# EAGLE schematic Relaya_original (EAGLE 9.1.2)
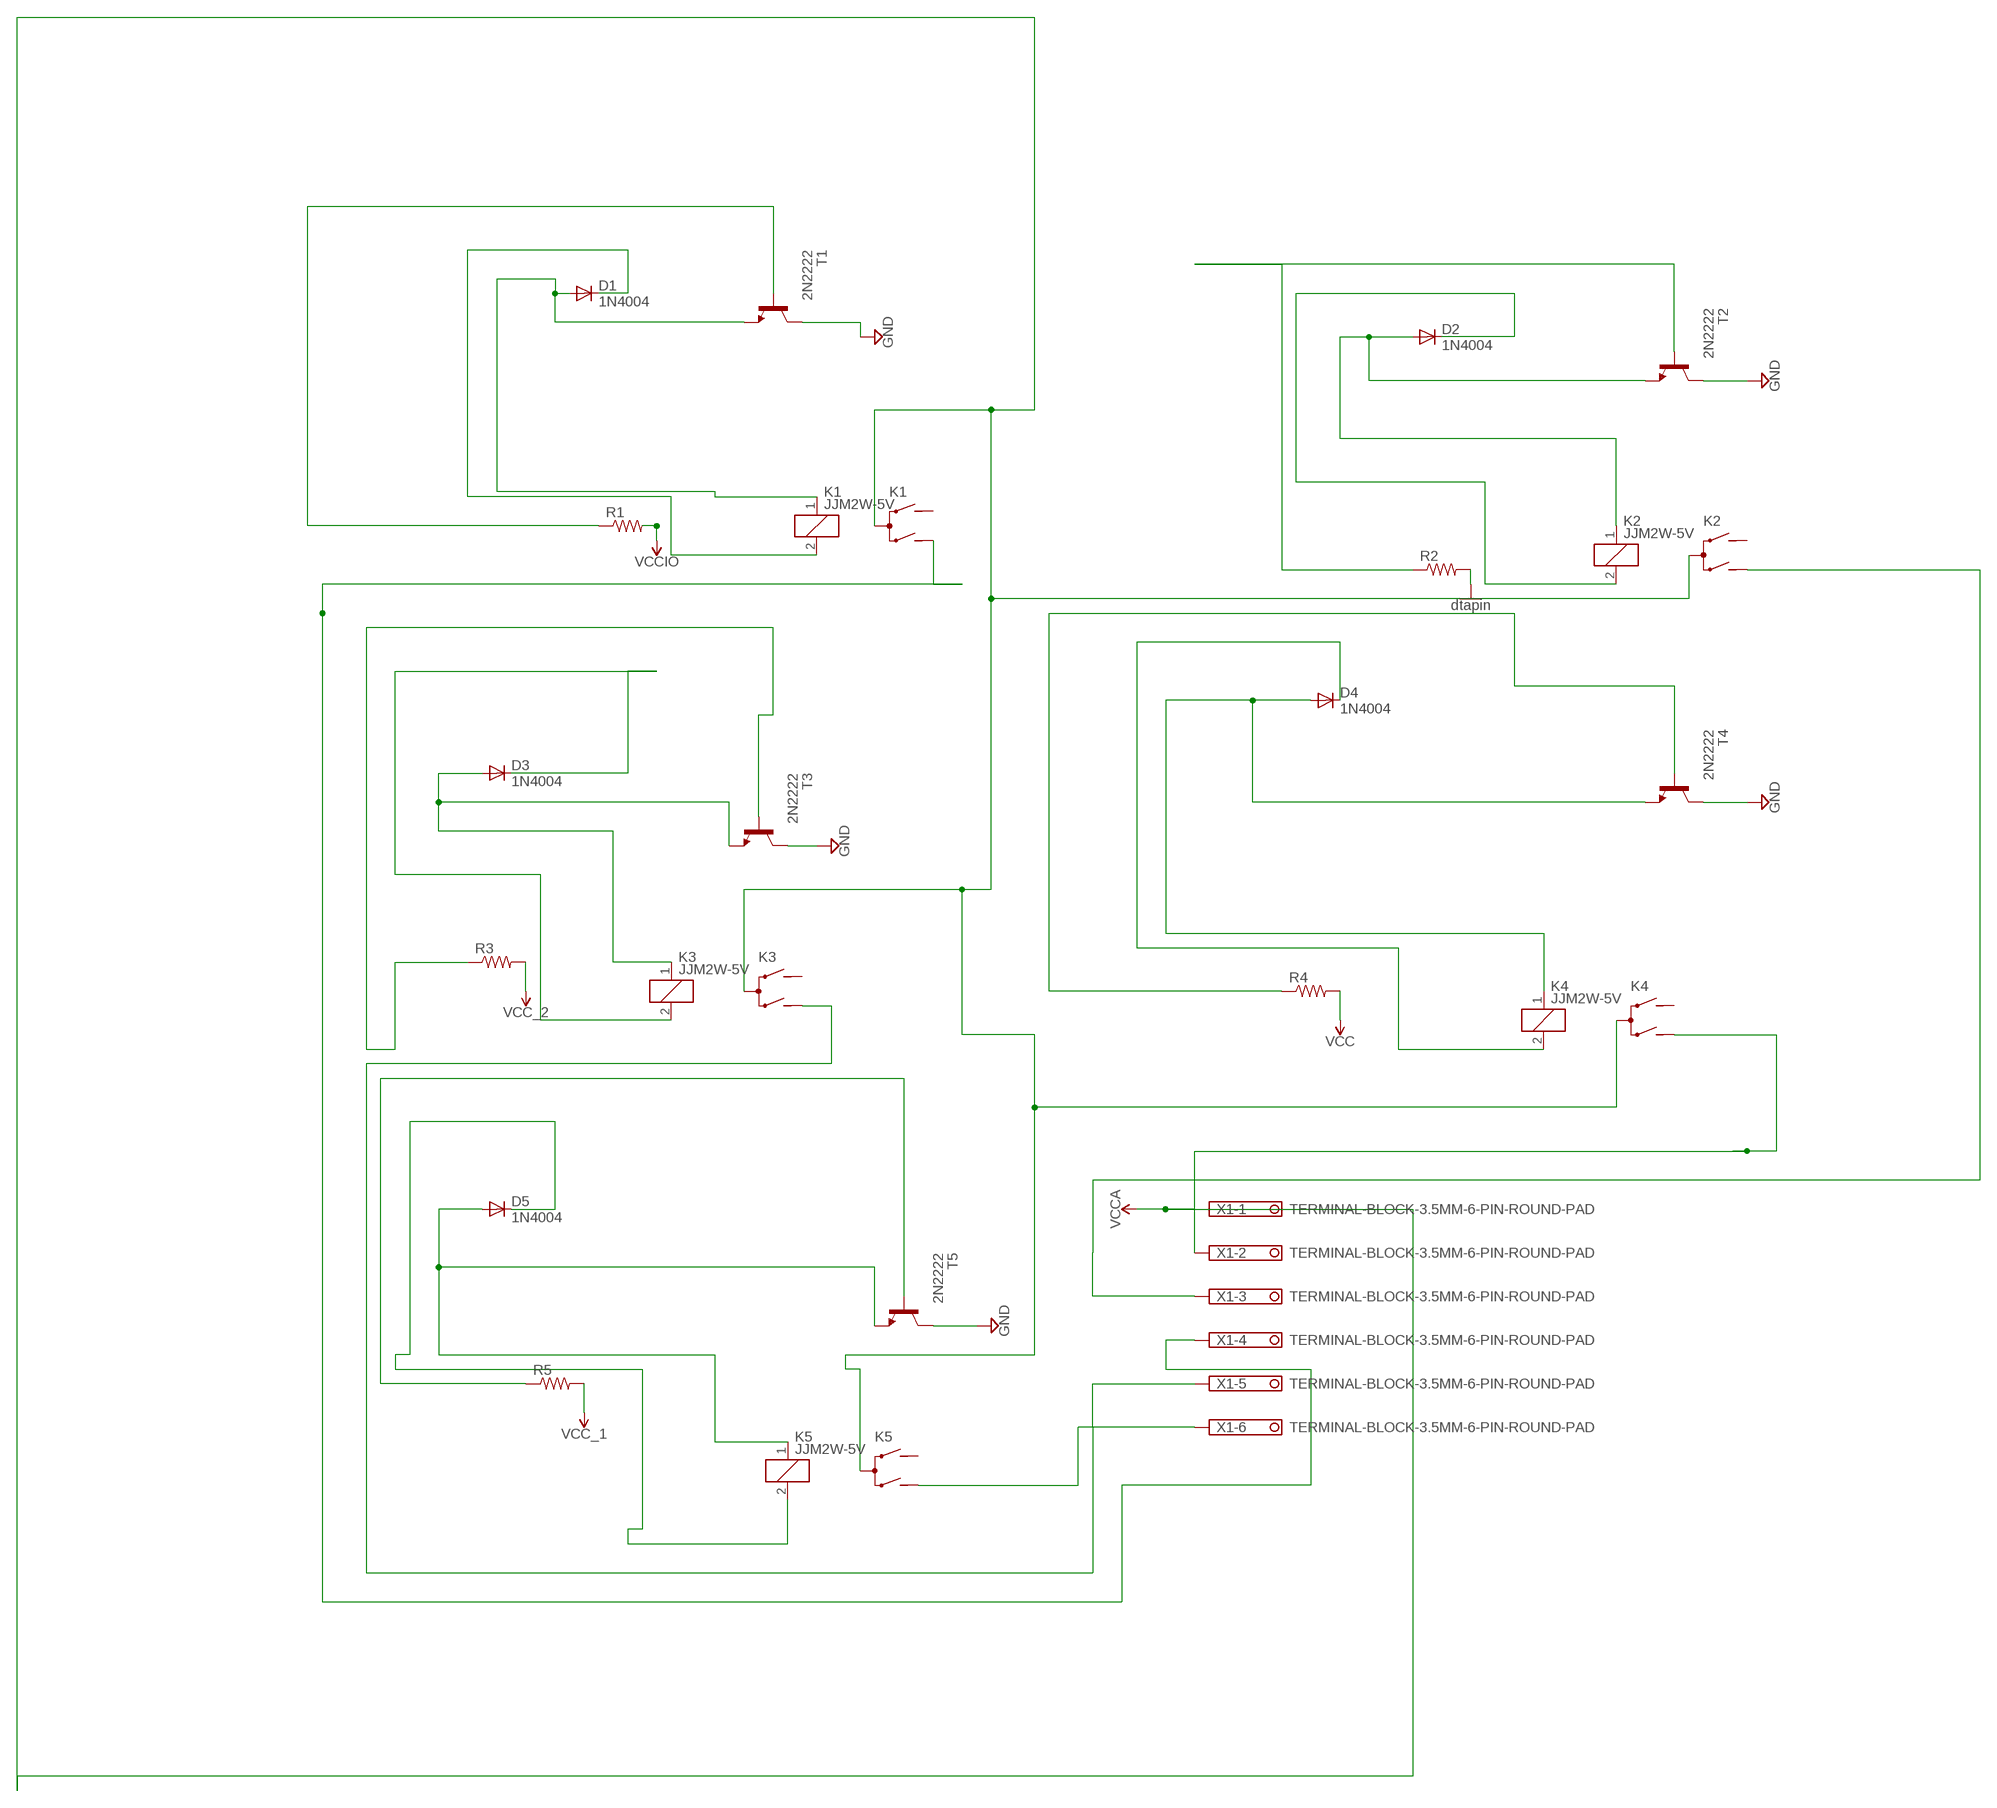
[diagram p0: schematic, sheet 1]

## Parts
D1  1N4004  [DO41-10]
D2  1N4004  [DO41-10]
D3  1N4004  [DO41-10]
D4  1N4004  [DO41-10]
D5  1N4004  [DO41-10]
K1  JJM2W-5V  JJM2W-12V  [JJM]
K2  JJM2W-5V  JJM2W-12V  [JJM]
K3  JJM2W-5V  JJM2W-12V  [JJM]
K4  JJM2W-5V  JJM2W-12V  [JJM]
K5  JJM2W-5V  JJM2W-12V  [JJM]
R1  R-US_0204/2V  [0204V]
R2  R-US_0204/2V  [0204V]
R3  R-US_0204/2V  [0204V]
R4  R-US_0204/2V  [0204V]
R5  R-US_0204/2V  [0204V]
T1  2N2222  [TO92-EBC-OVAL]
T2  2N2222  [TO92-EBC-OVAL]
T3  2N2222  [TO92-EBC-OVAL]
T4  2N2222  [TO92-EBC-OVAL]
T5  2N2222  [TO92-EBC-OVAL]
X1  TERMINAL-BLOCK-3.5MM-6-PIN-ROUND-PAD  [TERMINAL-BLOCK-6-PIN-3.5MM-ROUND-PAD]

## Nets
GND [Power]: R2.2 T1.C T2.C T3.C T4.C T5.C ; supply symbol labelled dtapin
N$1 [Data]: D1.A K1.1 T1.E
N$2 [Data]: R1.1 T1.B
N$3 [Data]: D2.A K2.1 T2.E
N$4 [Data]: R3.1 T3.B
N$5 [Data]: R2.1 T2.B
N$6 [Data]: D2.C K2.2
N$7 [Data]: D1.C K1.2
N$8 [Data]: D3.C K3.2
N$9 [Data]: D3.A K3.1 T3.E
N$10 [Data]: D4.C K4.2
N$11 [Data]: D4.A K4.1 T4.E
N$12 [Data]: R4.1 T4.B
N$14 [Data]: R5.1 T5.B
N$15 [Data]: D5.C K5.2
N$16 [Data]: D5.A K5.1 T5.E
N$26 [Data]: K5.NO2(2:NO2) X1.6
N$27 [Data]: K3.NO2(2:NO2) X1.5
N$28 [Data]: K1.NO2(2:NO2) X1.4
N$29 [Data]: K4.NO2(2:NO2) X1.2
N$31 [Data]: K2.NO2(2:NO2) X1.3
VCC: R4.2
VCC_1: R5.2
VCC_2: R3.2
VCCA [Power]: K1.C(2:C) K2.C(2:C) K3.C(2:C) K4.C(2:C) K5.C(2:C) X1.1
VCCIO: R1.2
Unconnected: K1.NO1(2:NO1) K2.NO1(2:NO1) K3.NO1(2:NO1) K4.NO1(2:NO1) K5.NO1(2:NO1)

## Library data of the parts
D1-D5 = adafruit:1N4004: DIODE General purpose 1N400x type rectifier (With bigger pads) http://www.ladyada.net/library/pcb/eaglelibrary.html
K1-K5 = relay:JJM2W-12V: DOUBLE MAKE CONTACT AUTOMOTIVE RELAY NAiS Source: http://www.mew-europe.com/.. en_ds_61210_0002.pdf; OC_FARNELL: unknown; OC_NEWARK: unknown
R1-R5 = adafruit:R-US_: RESISTOR, American symbol
T1-T5 = adafruit:2N2222: NPN TRANSISTOR Big oval pads
X1 = Rembrandt Electronics - Terminal Block 3-5mm v1-0:TERMINAL-BLOCK-3.5MM-6-PIN: Terminal Block 3.5mm Pitch: 3,5 mm Number of pins: 6 Created by Rembrandt Electronics www.rembrandtelectronics.com

## Net classes
1 Power: width 0.762 mm, drill 0.762 mm, clearance 0.635 mm
2 Data: width 0.762 mm, drill 0.762 mm, clearance 0.635 mm